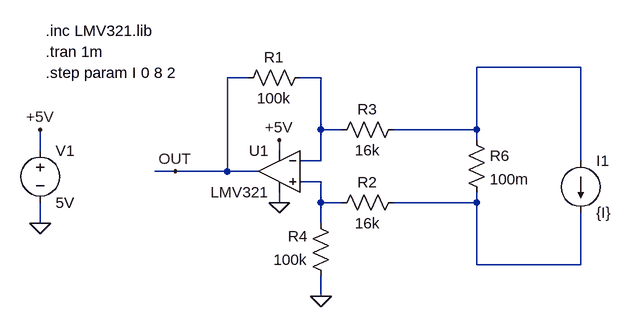
[diagram p0: schematic Differnezverstärker.asc]
Differnezverstärker.asc, the LTspice schematic file:
Version 4
SHEET 1 1036 680
WIRE 704 0 544 0
WIRE 192 16 160 16
WIRE 304 16 272 16
WIRE 304 96 304 16
WIRE 336 96 304 96
WIRE 544 96 544 0
WIRE 544 96 416 96
WIRE 544 112 544 96
WIRE -128 128 -128 96
WIRE 240 128 240 112
WIRE 304 144 304 96
WIRE 304 144 272 144
WIRE 704 144 704 0
WIRE 80 160 48 160
WIRE 160 160 160 16
WIRE 160 160 80 160
WIRE 208 160 160 160
WIRE 304 176 272 176
WIRE 240 208 240 192
WIRE 304 208 304 176
WIRE 336 208 304 208
WIRE 544 208 544 192
WIRE 544 208 416 208
WIRE -128 240 -128 208
WIRE 304 240 304 208
WIRE 544 304 544 208
WIRE 704 304 704 224
WIRE 704 304 544 304
WIRE 304 352 304 320
FLAG -128 240 0
FLAG -128 96 +5V
FLAG 240 112 +5V
FLAG 240 208 0
FLAG 304 352 0
FLAG 80 160 OUT
SYMBOL voltage -128 112 R0
WINDOW 123 0 0 Left 2
WINDOW 39 0 0 Left 2
SYMATTR InstName V1
SYMATTR Value 5V
SYMBOL res 288 0 R90
WINDOW 0 0 56 VBottom 2
WINDOW 3 32 56 VTop 2
SYMATTR InstName R1
SYMATTR Value 100k
SYMBOL res 432 192 R90
WINDOW 0 0 56 VBottom 2
WINDOW 3 32 56 VTop 2
SYMATTR InstName R2
SYMATTR Value 16k
SYMBOL res 432 80 R90
WINDOW 0 0 56 VBottom 2
WINDOW 3 32 56 VTop 2
SYMATTR InstName R3
SYMATTR Value 16k
SYMBOL res 320 336 R180
WINDOW 0 36 76 Left 2
WINDOW 3 36 40 Left 2
SYMATTR InstName R4
SYMATTR Value 100k
SYMBOL res 528 96 R0
SYMATTR InstName R6
SYMATTR Value 100m
SYMBOL Opamps\\opamp2 240 96 M0
SYMATTR InstName U1
SYMATTR Value LMV321
SYMBOL current 704 144 R0
WINDOW 123 0 0 Left 2
WINDOW 39 0 0 Left 2
SYMATTR InstName I1
SYMATTR Value {I}
TEXT -120 -56 Left 2 !.inc LMV321.lib
TEXT -120 -24 Left 2 !.tran 1m
TEXT -120 8 Left 2 !.step param I 0 8 2

The netlist it stands for:
* Differnezverstärker.asc
V1 +5V 0 5V
R1 N002 OUT 100k
R2 N004 N003 16k
R3 N001 N002 16k
R4 0 N003 100k
R6 N001 N004 100m
XU1 N003 N002 +5V 0 OUT LMV321  ; pins In+ In- V+ V- OUT
I1 N001 N004 {I}
.inc LMV321.lib
.tran 1m
.step param I 0 8 2
.backanno
.end